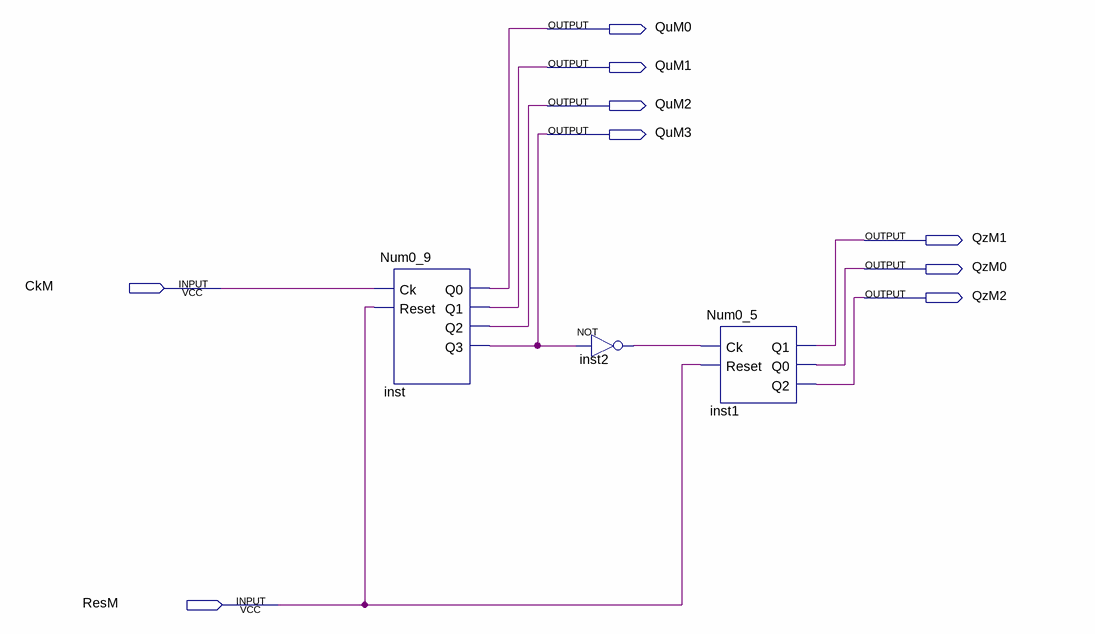
[diagram p0: schematic sheet]
// Quartus schematic NumM.bdf as structural Verilog: 3 symbols, 9 pins
module NumM (
  input  CkM,
  input  ResM,
  output QuM0,
  output QuM1,
  output QuM2,
  output QuM3,
  output QzM1,
  output QzM0,
  output QzM2
);

  wire inst2_out;

  Num0_9 inst (.Ck(CkM), .Reset(ResM), .Q0(QuM0), .Q1(QuM1), .Q2(QuM2), .Q3(QuM3));
  not inst2 (inst2_out, QuM3);
  Num0_5 inst1 (.Ck(inst2_out), .Reset(ResM), .Q1(QzM1), .Q0(QzM0), .Q2(QzM2));
endmodule
